# EAGLE schematic PCB_Central (EAGLE 6.4)
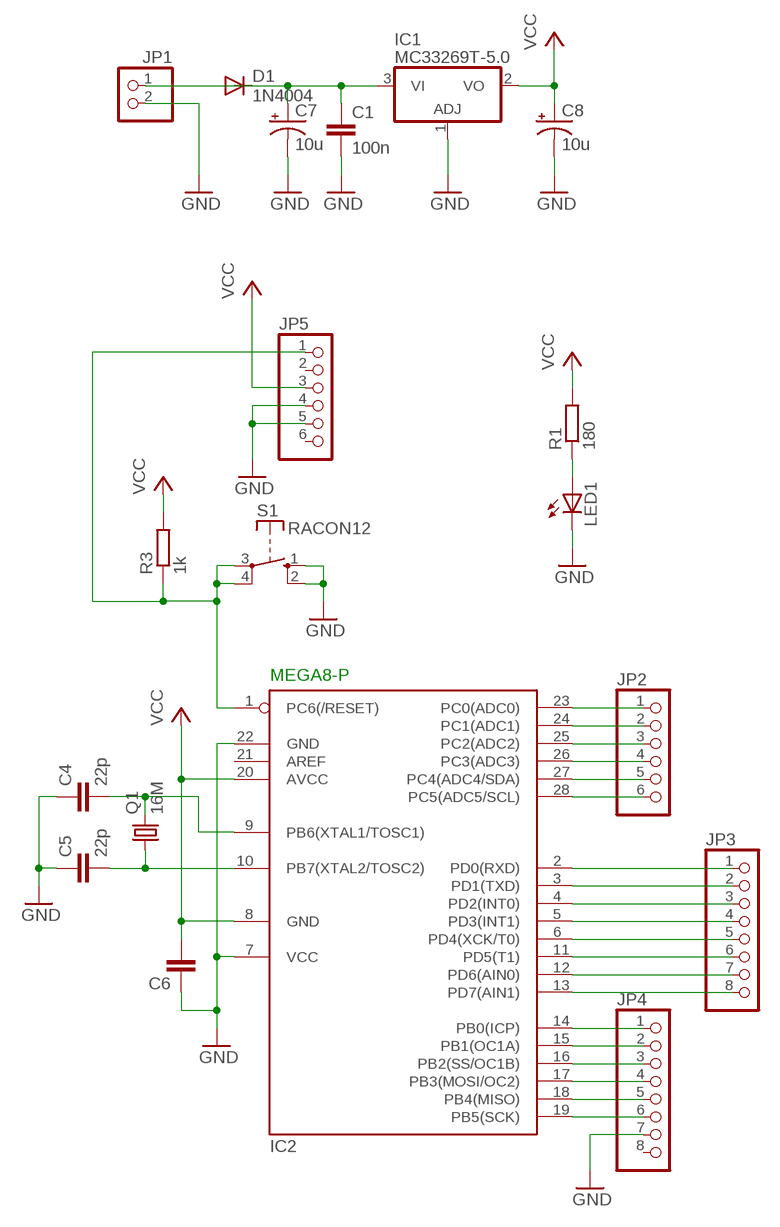
[diagram p0: schematic, sheet 1]

## Parts
C1  100n  C2,5-3  [C2.5-3]
C4  22p  C2,5-3  [C2.5-3]
C5  22p  C2,5-3  [C2.5-3]
C6  C2,5-3  [C2.5-3]
C7  10u  CPOL-USE5-13  [E5-13]
C8  10u  CPOL-USE5-13  [E5-13]
D1  1N4004  [DO41-10]
IC1  MC33269T-5.0  [TO220V]
IC2  MEGA8-P  [DIL28-3]
JP1  PINHD-1X2  [1X02]
JP2  PINHD-1X6  [1X06]
JP3  PINHD-1X8  [1X08]
JP4  PINHD-1X8  [1X08]
JP5  PINHD-1X6  [1X06]
LED1  LED5MM  [LED5MM]
Q1  16M  CRYSTALHC49S  [HC49/S]
R1  180  R-EU_0207/12  [0207/12]
R3  1k  R-EU_0207/12  [0207/12]
S1  RACON12  [RACON12]

## Nets
GND: C1.2 C4.1 C5.1 C6.1 C7.- C8.- IC1.1(ADJ) IC2.7(VCC) IC2.22(GND) JP1.2 JP4.7 JP5.4 JP5.5 LED1.K(C) S1.1(S) S1.2(S)
N$1: LED1.A R1.1
N$2: C1.1 C7.+ D1.A D1.C IC1.3(VI) JP1.1
N$3: IC2.1(PC6(/RESET)) JP5.1 R3.1 S1.3(P) S1.4(P)
N$4: IC2.14(PB0(ICP)) JP4.1
N$5: IC2.15(PB1(OC1A)) JP4.2
N$6: IC2.16(PB2(SS/OC1B)) JP4.3
N$7: IC2.17(PB3(MOSI/OC2)) JP4.4
N$8: IC2.18(PB4(MISO)) JP4.5
N$9: IC2.19(PB5(SCK)) JP4.6
N$10: C4.2 IC2.9(PB6(XTAL1/TOSC1)) Q1.2
N$11: C5.2 IC2.10(PB7(XTAL2/TOSC2)) Q1.1
N$12: IC2.23(PC0(ADC0)) JP2.1
N$13: IC2.24(PC1(ADC1)) JP2.2
N$14: IC2.25(PC2(ADC2)) JP2.3
N$15: IC2.26(PC3(ADC3)) JP2.4
N$16: IC2.27(PC4(ADC4/SDA)) JP2.5
N$17: IC2.28(PC5(ADC5/SCL)) JP2.6
N$18: IC2.2(PD0(RXD)) JP3.1
N$19: IC2.3(PD1(TXD)) JP3.2
N$20: IC2.4(PD2(INT0)) JP3.3
N$21: IC2.5(PD3(INT1)) JP3.4
N$22: IC2.6(PD4(XCK/T0)) JP3.5
N$23: IC2.11(PD5(T1)) JP3.6
N$24: IC2.12(PD6(AIN0)) JP3.7
N$25: IC2.13(PD7(AIN1)) JP3.8
VCC: C6.2 C8.+ IC1.2(VO) IC2.8(GND) IC2.20(AVCC) JP5.3 R1.2 R3.2
Unconnected: IC2.21(AREF) JP4.8 JP5.2 JP5.6

## Library data of the parts
C1 C4-C6 = capacitor-wima:C: CAPACITOR naming: grid - package width
C7 C8 = resistor:CPOL-US: POLARIZED CAPACITOR, American symbol
D1 = diode:1N4004: DIODE general purpose rectifier, 1 A
IC1 = linear:MC33269?*: Adjustable Output Low Dropout Voltage Regulator 800 mA Source: http://www.onsemi.com/pub/Collateral/MC33269-D.PDF
IC2 = atmel:MEGA8-P: MICROCONTROLLER 8 Kbytes FLASH, 1 kbytes SRAM, 512 bytes EEPROM, USART, 4-channel 10 bit ADC, 2-channel 8 bit ADC Pin compatible with Atmega48, ATMega88, ATMega168 Source: avr.lbr; OC_FARNELL: unknown; OC_NEWARK: unknown
JP1 = pinhead:PINHD-1X2: PIN HEADER
JP2 JP5 = pinhead:PINHD-1X6: PIN HEADER
JP3 JP4 = pinhead:PINHD-1X8: PIN HEADER
LED1 = led:LED: LED OSRAM: - CHIPLED LG R971, LG N971, LY N971, LG Q971, LY Q971, LO R971, LY R971 LH N974, LH R974 LS Q976, LO Q976, LY Q976 LO Q996 - Hyper CHIPLED LW Q18S LB Q993, LB Q99A, LB R99A - SideLED LS A670, LO A670, LY A670, LG A670, LP A670 LB A673, LV A673, LT A673, LW A673 LH A674 LY A675 LS A676, LA A676, LO A676, LY A676, LW A676 LS A679, LY A679, LG A679 - Hyper Micro SIDELED® LS Y876, LA Y876, LO Y876, LY Y876 LT Y87S - SmartLED LW L88C, LW L88S LB L89C, LB L89S, LG L890 LS L89K, LO L89K, LY L89K LS L896, LA L896, LO L896, LY L896 - TOPLED LS T670, LO T670, LY T670, LG T670, LP T670 LSG T670, LSP T670, LSY T670, LOP T670, LYG T670 LG T671, LOG T671, LSG T671 LB T673, LV T673, LT T673, LW T673 LH T674 LS T676, LA T676, LO T676, LY T676, LB T676, LH T676, LSB T676, LW T676 LB T67C, LV T67C, LT T67C, LS T67K, LO T67K, LY T67K, LW E67C LS E67B, LA E67B, LO E67B, LY E67B, LB E67C, LV E67C, LT E67C LW T67C LS T679, LY T679, LG T679 LS T770, LO T770, LY T770, LG T770, LP T770 LB T773, LV T773, LT T773, LW T773 LH T774 LS E675, LA E675, LY E675, LS T675 LS T776, LA T776, LO T776, LY T776, LB T776 LHGB T686 LT T68C, LB T68C - Hyper Mini TOPLED® LB M676 - Mini TOPLED Santana® LG M470 LS M47K, LO M47K, LY M47K Source: http://www.osram.convergy.de LUXEON: - LUMILED® LXK2-PW12-R00, LXK2-PW12-S00, LXK2-PW14-U00, LXK2-PW14-V00 LXK2-PM12-R00, LXK2-PM12-S00, LXK2-PM14-U00 LXK2-PE12-Q00, LXK2-PE12-R00, LXK2-PE12-S00, LXK2-PE14-T00, LXK2-PE14-U00 LXK2-PB12-K00, LXK2-PB12-L00, LXK2-PB12-M00, LXK2-PB14-N00, LXK2-PB14-P00, LXK2-PB14-Q00 LXK2-PR12-L00, LXK2-PR12-M00, LXK2-PR14-Q00, LXK2-PR14-R00 LXK2-PD12-Q00, LXK2-PD12-R00, LXK2-PD12-S00 LXK2-PH12-R00, LXK2-PH12-S00 LXK2-PL12-P00, LXK2-PL12-Q00, LXK2-PL12-R00 Source: www.luxeon.com KINGBRIGHT: KA-3528ASYC Source: www.kingbright.com
Q1 = crystal:CRYSTAL: CRYSTAL; OC_FARNELL: 1667008; OC_NEWARK: unknown
R1 R3 = resistor:R-EU_: RESISTOR, European symbol
S1 = switch-misc:RACON12: ITT SWITCH